# Altium schematic sheet current sense.SchDoc
size A4; SheetNumber: 4; SheetTotal: 4
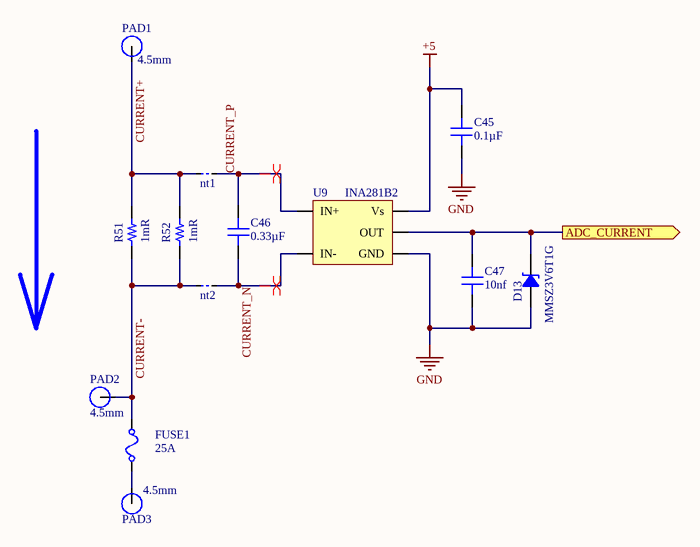
[diagram p0: current sense.SchDoc]

## Parts
C45  0.1µF  [CAP 0805_2012]
C46  0.33µF  [CAP 0805_2012]
C47  10nf  [CAP 0805_2012]
D13  MMSZ3V6T1G  [SOD-123]
FUSE1  25A  [3522 ATOF FUSE]
nt1  NET TIE 2  [0.3mm]  (value not drawn)  (net tie, no BOM)
nt2  NET TIE 2  [0.3mm]  (value not drawn)  (net tie, no BOM)
PAD1  4.5mm  [Single Pad 4.5mm]
PAD2  4.5mm  [Single Pad 4.5mm]
PAD3  4.5mm  [Single Pad 4.5mm]
R51  1mR  [2512_bvt]
R52  1mR  [2512_bvt]
U9  INA281B2  [SOT-23(INA281)_H]

## Ports
ADC_CURRENT (out)

## Nets
+5: C45.2 U9.3(Vs)
GND: C45.1 C47.1 D13.1 U9.2(GND)
ADC_CURRENT: C47.2 D13.2 U9.1(OUT) ; port ADC_CURRENT
CURRENT+: nt1.1 PAD1.1 R51.2 R52.2
CURRENT-: FUSE1.2 nt2.1 PAD2.1 R51.1 R52.1
CURRENT_N: C46.1 nt2.2 U9.5(IN-)
CURRENT_P: C46.2 nt1.2 U9.4(IN+)
NetFUSE1_1: FUSE1.1 PAD3.1

## Layout directives
differential pair; differential pair class current: CURRENT_N, CURRENT_P

## Library data of the parts
C45 = AS0805KKX7R0BB104: CAP CER 0.1UF 100V X7R 0805; Manufacturer: Yageo; Tolerance: ±10%; Part Number: AS0805KKX7R0BB104; Value: 0.1µF; Applications: Automotive, Boardflex Sensitive; Capacitance: 0.1µF; ComponentLink1Description: Datasheet; ComponentLink1URL: http://www.yageo.com/NewPortal/yageodocoutput?fileName=/pdf/MLCC/UPY-AS_X7R_16V-to-630V_0.pdf; ComponentLink2Description: DigiKey Link; ComponentLink2URL: http://digikey.com/product-detail/en/yageo/AS0805KKX7R0BB104/311-4581-1-ND/8605488; Device Package: 0805 (2012 Metric); Features: Soft Termination; LastUpdated: 9/2/2020 1:04:41 AM; Lifecycle Status: Active; Minimum Order: 1; Mounting Type: Surface Mount, MLCC; Operating Temperature: -55°C ~ 125°C; Package / Case: 0805 (2012 Metric); Packaging: TapeAndReel; PartId: 2704; Part Status: Active; Price: 0.08; Ratings: AEC-Q200; Series: AS; Size / Dimension: 0.079" L x 0.049" W (2.00mm x 1.25mm); Supplier 1: DigiKey; Supplier Part Number 1: 311-4581-1-ND; Temperature Coefficient: X7R; Thickness (Max): 0.057" (1.45mm); Voltage - Rated: 100V
C46 = C0805C334K5RECAUTO: CAP CER 0805 330NF 50V X7R 10%; Manufacturer: KEMET; Part Number: C0805C334K5RECAUTO; Value: 0.33µF; Applications: Automotive, ESD Protection; Capacitance: 0.33µF; ComponentLink1Description: Datasheet; ComponentLink1URL: https://api.kemet.com/component-edge/download/datasheet/C0805C334K5RECAUTO.pdf; ComponentLink2Description: DigiKey Link; ComponentLink2URL: http://digikey.com/product-detail/en/kemet/C0805C334K5RECAUTO/399-17888-1-ND/8640555; Device Package: 0805 (2012 Metric); LastUpdated: 9/2/2020 1:04:15 AM; Lifecycle Status: Active; Minimum Order: 1; Mounting Type: Surface Mount, MLCC; Operating Temperature: -55°C ~ 125°C; Package / Case: 0805 (2012 Metric); Packaging: TapeAndReel; PartId: 15715; Part Status: Active; Price: 0.05; Ratings: AEC-Q200; Series: ESD SMD Auto X7R; Size / Dimension: 0.079" L x 0.049" W (2.00mm x 1.25mm); Supplier 1: DigiKey; Supplier Part Number 1: 399-17888-1-ND; Temperature Coefficient: X7R; Thickness (Max): 0.039" (1.00mm); Tolerance: ±10%; Voltage - Rated: 50V
C47 = C0805X103K1RAC3316: CAP CER 0805 10NF 100V X7R; Manufacturer: KEMET; Capacitance: 10000pF; Tolerance: ±10%; Part Number: C0805X103K1RAC3316; Value: 10nf; Applications: Automotive, Boardflex Sensitive; ComponentLink1Description: Datasheet; ComponentLink1URL: https://api.kemet.com/component-edge/download/datasheet/C0805X103K1RAC3316.pdf; ComponentLink2Description: DigiKey Link; ComponentLink2URL: http://digikey.com/product-detail/en/kemet/C0805X103K1RAC3316/399-C0805X103K1RAC3316CT-ND/10315836; Device Package: 0805 (2012 Metric); Features: Soft Termination; LastUpdated: 9/2/2020 1:04:42 AM; Lifecycle Status: Active; Minimum Order: 1; Mounting Type: Surface Mount, MLCC; Operating Temperature: -55°C ~ 125°C; Package / Case: 0805 (2012 Metric); Packaging: TapeAndReel; PartId: 2565; Part Status: Active; Price: 0.02; Ratings: AEC-Q200; Series: SMD Auto X7R VW80808; Size / Dimension: 0.079" L x 0.049" W (2.00mm x 1.25mm); Supplier 1: DigiKey; Supplier Part Number 1: 399-C0805X103K1RAC3316CT-ND; Temperature Coefficient: X7R; Thickness (Max): 0.039" (0.98mm); Voltage - Rated: 100V
D13 = MMSZ3V6T1G: DIODE ZENER 3.6V 500MW SOD123; Manufacturer: ON Semiconductor; Current - Reverse Leakage @ Vr: 5µA @ 1V; Impedance (Max) (Zzt): 90 Ohms; Tolerance: ±5%; Voltage - Forward (Vf) (Max) @ If: 900mV @ 10mA; Part Number: MMSZ3V6T1G; ComponentLink1Description: Datasheet; ComponentLink1URL: http://www.onsemi.com/pub/Collateral/MMSZ2V4T1-D.PDF; ComponentLink2Description: DigiKey Link; ComponentLink2URL: http://digikey.com/product-detail/en/on-semiconductor/MMSZ3V6T1G/MMSZ3V6T1GOSCT-ND/2121110; LastUpdated: 9/2/2020 1:19:27 AM; Lifecycle Status: Active; Minimum Order: 1; Mounting Type: Surface Mount; Operating Temperature: -55°C ~ 150°C; Package / Case: SOD-123; Packaging: TapeAndReel; PartId: 1892; Part Status: Active; Power - Max: 500mW; Price: 0.04; Series: -; Supplier 1: DigiKey; Supplier Part Number 1: MMSZ3V6T1GOSCT-ND; Supplier Device Package: SOD-123; Voltage - Zener (Nom) (Vz): 3.6V
FUSE1 = ATOF Fuse 3522: 3522 ATOF automotive fuse; Value: 25A
PAD1-PAD3 = Single Pad 4.5mm
R51 R52 = CSS2H-2512R-1L00FE: Res Metal Strip 2512 0.001 Ohm 1% 5W ±75ppm/°C Pad SMD Automotive T/R; Manufacturer: Bourns; Temperature Coefficient: 50ppm/°C; Supplier 1: Digi-Key; Manufacturer Part Number: CSS2H-2512R-1L00FE; RoHS: Yes; Category: Chip SMD Resistors; Stock 1: 1491; Pricing 1: 1=0.88000, 10=0.77500, 25=0.71240, 50=0.65000, 100=0.56250, 250=0.47500, 500=0.40000 (USD); Case/Package: 2512; Case Code (Imperial): 2512; Case Code (Metric): 6432; Min Operating Temperature: -55°C; Max Operating Temperature: 170°C; Resistor Type: Metal Element; Features: Moisture Resistant; Packaging: Tape and Reel; Resistance: 1mR; Tolerance: 1%; Max Power Dissipation: 5W; Number of Terminations: 2; RoHS Compliant: Yes; ComponentLink1URL: https://www.bourns.com/docs/Product-Datasheets/css2h-2512.pdf?src-supplier=Digi-Key; ComponentLink1Description: https://www.bourns.com/docs/Product-Datasheets/css2h-2512.pdf?src-supplier=Digi-Key
U9 = INA281B2IDBVR: Gain: 50V/V; ComponentLink1Description: New link; ComponentLink1URL: https://www.digikey.com/en/products/detail/texas-instruments/INA281B2IDBVR/13238583